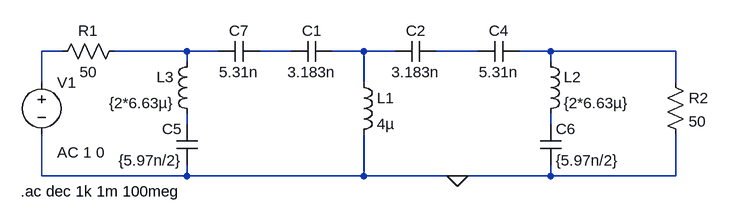
[diagram p0: schematic circ_desnormalizado.asc]
circ_desnormalizado.asc, the LTspice schematic file:
Version 4
SHEET 1 984 680
WIRE -16 64 -48 64
WIRE 176 64 64 64
WIRE 224 64 176 64
WIRE 336 64 288 64
WIRE 448 64 400 64
WIRE 496 64 448 64
WIRE 624 64 560 64
WIRE 736 64 688 64
WIRE 928 64 736 64
WIRE 176 80 176 64
WIRE 736 80 736 64
WIRE -48 112 -48 64
WIRE 448 112 448 64
WIRE 928 112 928 64
WIRE 176 176 176 160
WIRE 736 176 736 160
WIRE -48 256 -48 192
WIRE 176 256 176 240
WIRE 176 256 -48 256
WIRE 448 256 448 192
WIRE 448 256 176 256
WIRE 592 256 448 256
WIRE 736 256 736 240
WIRE 736 256 592 256
WIRE 928 256 928 192
WIRE 928 256 736 256
FLAG 592 256 0
SYMBOL voltage -48 96 R0
WINDOW 123 24 124 Left 2
WINDOW 39 0 0 Left 0
SYMATTR Value2 AC 1 0
SYMATTR InstName V1
SYMATTR Value ""
SYMBOL res 80 48 R90
WINDOW 0 0 56 VBottom 2
WINDOW 3 32 56 VTop 2
SYMATTR InstName R1
SYMATTR Value 50
SYMBOL cap 400 48 R90
WINDOW 0 0 32 VBottom 2
WINDOW 3 32 32 VTop 2
SYMATTR InstName C1
SYMATTR Value 3.183n
SYMBOL cap 560 48 R90
WINDOW 0 0 32 VBottom 2
WINDOW 3 32 32 VTop 2
SYMATTR InstName C2
SYMATTR Value 3.183n
SYMBOL ind 432 96 R0
SYMATTR InstName L1
SYMATTR Value 4µ
SYMBOL ind 720 64 R0
SYMATTR InstName L2
SYMATTR Value {2*6.63µ}
SYMBOL cap 720 176 R0
SYMATTR InstName C6
SYMATTR Value {5.97n/2}
SYMBOL cap 624 80 R270
WINDOW 0 32 32 VTop 2
WINDOW 3 0 32 VBottom 2
SYMATTR InstName C4
SYMATTR Value 5.31n
SYMBOL res 912 96 R0
SYMATTR InstName R2
SYMATTR Value 50
SYMBOL ind 192 64 M0
SYMATTR InstName L3
SYMATTR Value {2*6.63µ}
SYMBOL cap 192 176 M0
SYMATTR InstName C5
SYMATTR Value {5.97n/2}
SYMBOL cap 288 80 M270
WINDOW 0 32 32 VTop 2
WINDOW 3 0 32 VBottom 2
SYMATTR InstName C7
SYMATTR Value 5.31n
TEXT -80 280 Left 2 !.ac dec 1k 1m 100meg

The netlist it stands for:
* circ_desnormalizado.asc
V1 N001 0 AC 1 0
R1 N002 N001 50
C1 N004 N003 3.183n
C2 N005 N004 3.183n
L1 N004 0 4µ
L2 N006 N008 {2*6.63µ}
C6 N008 0 {5.97n/2}
C4 N005 N006 5.31n
R2 N006 0 50
L3 N002 N007 {2*6.63µ}
C5 N007 0 {5.97n/2}
C7 N003 N002 5.31n
.ac dec 1k 1m 100meg
.backanno
.end